# Altium schematic sheet Overall.SchDoc
size A4; SheetNumber: 1; SheetTotal: 1
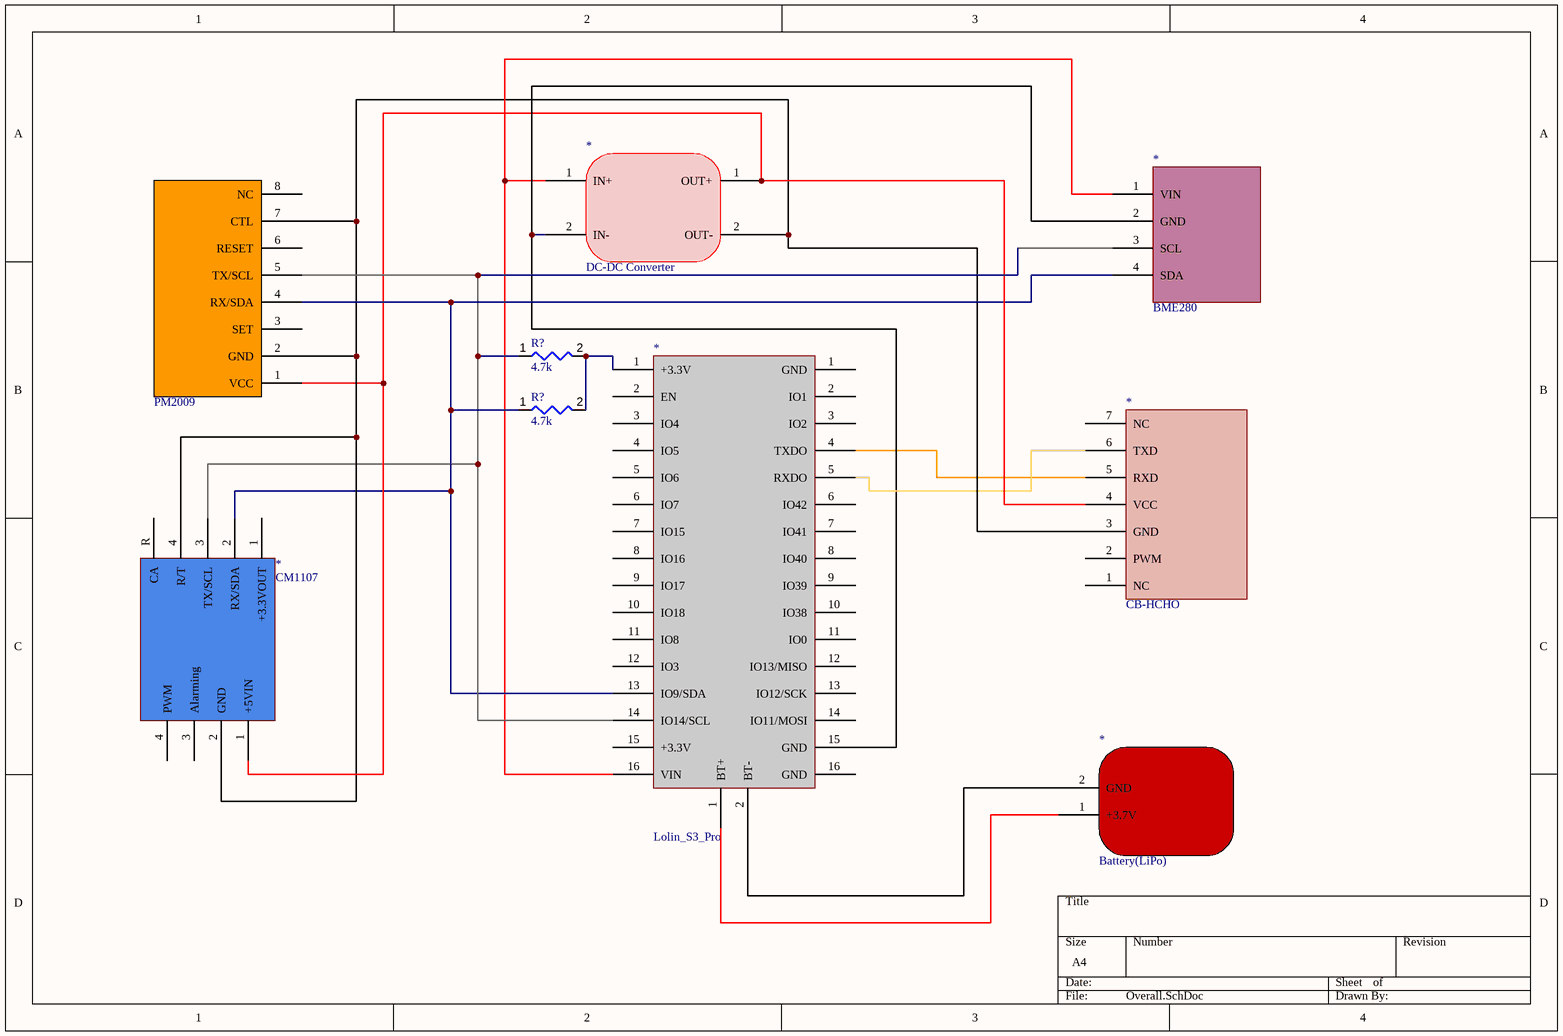
[diagram p0: Overall.SchDoc]

## Parts
(Parts that share a designator on the sheet are numbered #1, #2 ... from top to bottom, then left to right.)
*#1  DC-DC Converter
*#2  BME280
*#3  CB-HCHO
*#4  Lolin_S3_Pro
*#5  CM1107
*#6  Battery(LiPo)
?  PM2009
R?#1  value 4.7k  [RESC1005X40X25ML05T05]  (hidden comment: Resistor 4k7 +/-1% 0402 63 mW)
R?#2  value 4.7k  [RESC1005X40X25ML05T05]  (hidden comment: Resistor 4k7 +/-1% 0402 63 mW)

## Nets
Net*#1_1: *#1.1(OUT+) *#3.4(VCC) *#5.1(+5VIN) ?.1(VCC)
Net*#1_1: *#1.1(IN+) *#2.1(VIN) *#4.16(VIN)  [a separate net that carries the same name]
Net*#1_2: *#1.2(OUT-) *#3.3(GND) *#5.2(GND) *#5.4(PWM) ?.2(GND) ?.7(CTL)
Net*#1_2: *#1.2(IN-) *#2.2(GND) *#4.15(+3.3V)  [a separate net that carries the same name]
Net*#2_3: *#2.3(SCL) *#4.14(IO14/SCL) *#5.3(Alarming) ?.5(TX/SCL) R?#1.1
Net*#2_4: *#2.4(SDA) *#4.13(IO9/SDA) *#5.2(RX/SDA) ?.4(RX/SDA) R?#2.1
Net*#3_5: *#3.5(RXD) *#4.4(IO5)
Net*#3_6: *#3.6(TXD) *#4.5(IO6)
Net*#4_1: *#4.1(BT+) *#6.1(+3.7V)
Net*#4_1: *#4.1(+3.3V) R?#1.2 R?#2.2  [a separate net that carries the same name]
Net*#4_2: *#4.2(EN) *#6.2(GND)

Not connected (* = marked no-connect by the designer): *#3 1(NC) 2(PWM) 7(NC); *#4 3(IO4) 6(IO7) 7(IO15) 8(IO16) 9(IO17) 10(IO18) 11(IO8) 12(IO3); *#5 R(CA); ? 3(SET) 6(RESET) 8(NC)

## Library data of the parts
R?#1 R?#2 = CMP-009-00034-5: Chip Resistor, 4.7 KOhm, +/- 1%, 63 mW, -55 to 155 degC, 0402 (1005 Metric); Power: 63mW; Voltage Rating: 50V; Case/Package: 0402; Tolerance: 1%; Max Operating Temperature: 155°C; Pins: 2; RoHS Compliant: True; Min Operating Temperature: -55°C; Mounting Technology: SM